# EAGLE design EndingsACMixOutput (EAGLE 9.6.2)
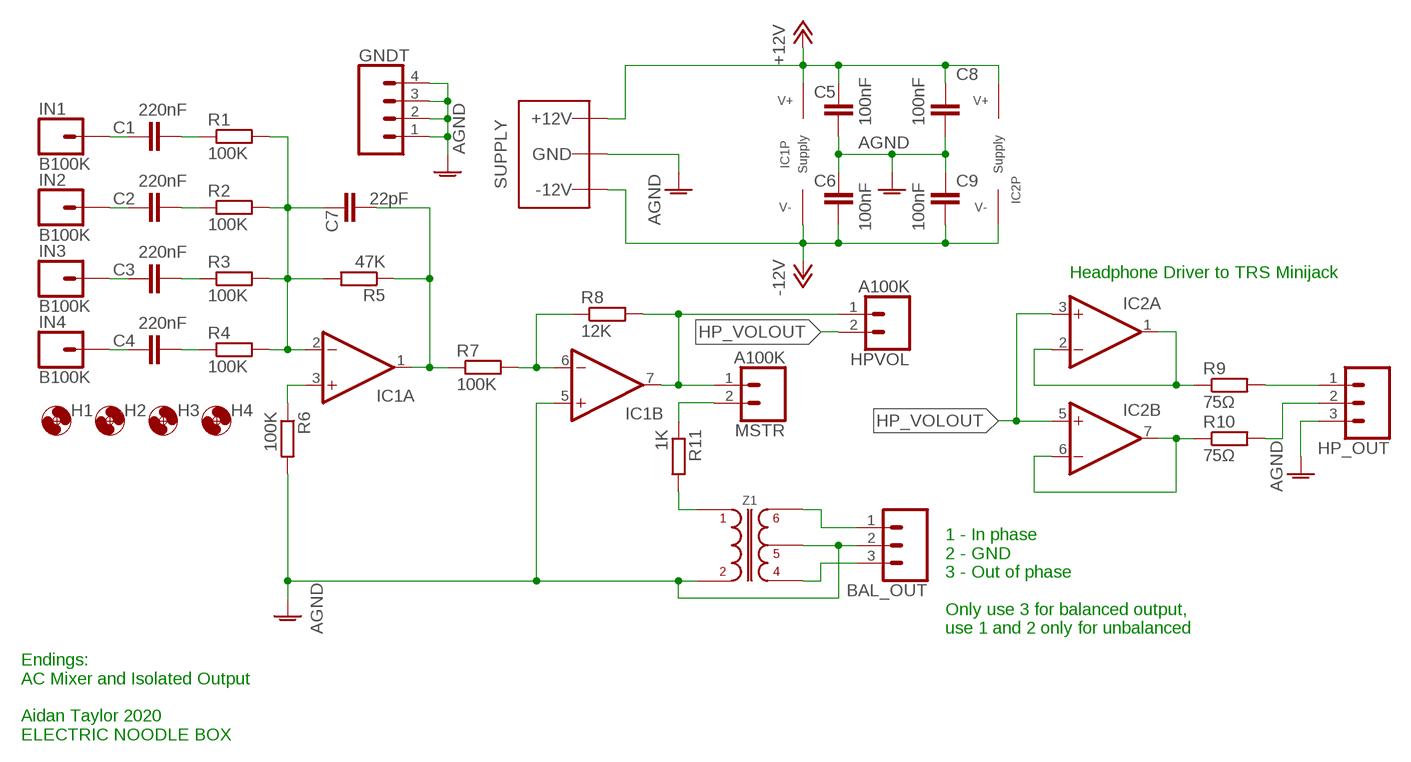
[diagram p0: schematic, sheet 1]

## Parts
BAL_OUT  3XWIREPAD  [1X03]
C1  220nF  C-EU050-025X075  [C050-025X075]
C2  220nF  C-EU050-025X075  [C050-025X075]
C3  220nF  C-EU050-025X075  [C050-025X075]
C4  220nF  C-EU050-025X075  [C050-025X075]
C5  100nF  C-EU050-025X075  [C050-025X075]
C6  100nF  C-EU050-025X075  [C050-025X075]
C7  22pF  C-EU050-025X075  [C050-025X075]
C8  100nF  C-EU050-025X075  [C050-025X075]
C9  100nF  C-EU050-025X075  [C050-025X075]
GNDT  4XWIREPAD  [1X04]
H1  MOUNT-HOLE3.2  [3,2]
H2  MOUNT-HOLE3.2  [3,2]
H3  MOUNT-HOLE3.2  [3,2]
H4  MOUNT-HOLE3.2  [3,2]
HP_OUT  3XWIREPAD  [1X03]
HPVOL  A100K  2XWIREPAD  [1X02]
IC1  TL0X2DIL  [DIL08]
IC2  TL0X2DIL  [DIL08]
IN1  B100K  1XWIREPAD  [1X01]
IN2  B100K  1XWIREPAD  [1X01]
IN3  B100K  1XWIREPAD  [1X01]
IN4  B100K  1XWIREPAD  [1X01]
MSTR  A100K  2XWIREPAD  [1X02]
R1  100K  R-EU_0207/10  [0207/10]
R2  100K  R-EU_0207/10  [0207/10]
R3  100K  R-EU_0207/10  [0207/10]
R4  100K  R-EU_0207/10  [0207/10]
R5  47K  R-EU_0207/10  [0207/10]
R6  100K  R-EU_0207/10  [0207/10]
R7  100K  R-EU_0207/10  [0207/10]
R8  12K  R-EU_0207/10  [0207/10]
R9  75Ω  R-EU_0207/10  [0207/10]
R10  75Ω  R-EU_0207/10  [0207/10]
R11  1K  R-EU_0207/10  [0207/10]
WP1  COMBO_SUPPLY_HEADER  [COMBINED_POWER]
Z1  Z1604_AUDIO_TRANSFORMER  [Z1604_TRANSFORMER]

## Nets
+12V: C5.1 C8.1 IC1.8(P:V+) IC2.8(P:V+) WP1.V+1(V++) WP1.V+2(V++) WP1.V+3(V++)
-12V: C6.2 C9.2 IC1.4(P:V-) IC2.4(P:V-) WP1.V-1(V--) WP1.V-2(V--) WP1.V-3(V--)
AGND: BAL_OUT.2 C5.2 C6.1 C8.2 C9.1 GNDT.1 GNDT.2 GNDT.3 GNDT.4 HP_OUT.3 IC1.5(B:+IN) R6.2 WP1.GND1(AGND) WP1.GND2(AGND) WP1.GND3(AGND) WP1.GND4(AGND) WP1.GND5(AGND) WP1.GND6(AGND) WP1.GND7(AGND) WP1.GND8(AGND) Z1.T3 Z1.T5
HP_VOLOUT: HPVOL.2 IC2.3(A:+IN) IC2.5(B:+IN)
N$1: C4.1 IN4.1
N$2: C7.1 IC1.2(A:-IN) R1.2 R2.2 R3.2 R4.2 R5.2
N$3: C7.2 IC1.1(A:OUT) R5.1 R7.1
N$4: IC1.6(B:-IN) R7.2 R8.1
N$5: HPVOL.1 IC1.7(B:OUT) MSTR.1 R8.2
N$6: C3.1 IN3.1
N$7: IC1.3(A:+IN) R6.1
N$8: C1.2 R1.1
N$9: C2.2 R2.1
N$10: C3.2 R3.1
N$11: C4.2 R4.1
N$12: C2.1 IN2.1
N$13: C1.1 IN1.1
N$14: MSTR.2 R11.1
N$15: BAL_OUT.1 Z1.T6
N$17: BAL_OUT.3 Z1.T4
N$18: IC2.1(A:OUT) IC2.2(A:-IN) R9.1
N$19: HP_OUT.1 R9.2
N$20: IC2.6(B:-IN) IC2.7(B:OUT) R10.1
N$21: HP_OUT.2 R10.2
N$22: R11.2 Z1.T1

## Notes on the sheet
- Headphone Driver to TRS Minijack
- 1 - In phase
  2 - GND
  3 - Out of phase
  
  Only use 3 for balanced output, 
  use 1 and 2 only for unbalanced
- Endings:
  AC Mixer and Isolated Output
  
  Aidan Taylor 2020
  ELECTRIC NOODLE BOX

## Library data of the parts
BAL_OUT HP_OUT = ElectricNoodleBox:3XWIREPAD
C1-C9 = rcl:C-EU: CAPACITOR, European symbol; SPICEPREFIX: C
GNDT = ElectricNoodleBox:4XWIREPAD
H1-H4 = holes:MOUNT-HOLE: MOUNTING HOLE with drill center marker
HPVOL MSTR = ElectricNoodleBox:2XWIREPAD
IC1 IC2 = ElectricNoodleBox:TL0X2
IN1-IN4 = ElectricNoodleBox:1XWIREPAD
R1-R11 = rcl:R-EU_: RESISTOR, European symbol; SPICEPREFIX: R
WP1 = ElectricNoodleBox:COMBO_SUPPLY_HEADER
Z1 = ElectricNoodleBox:Z1604_AUDIO_TRANSFORMER

## Board
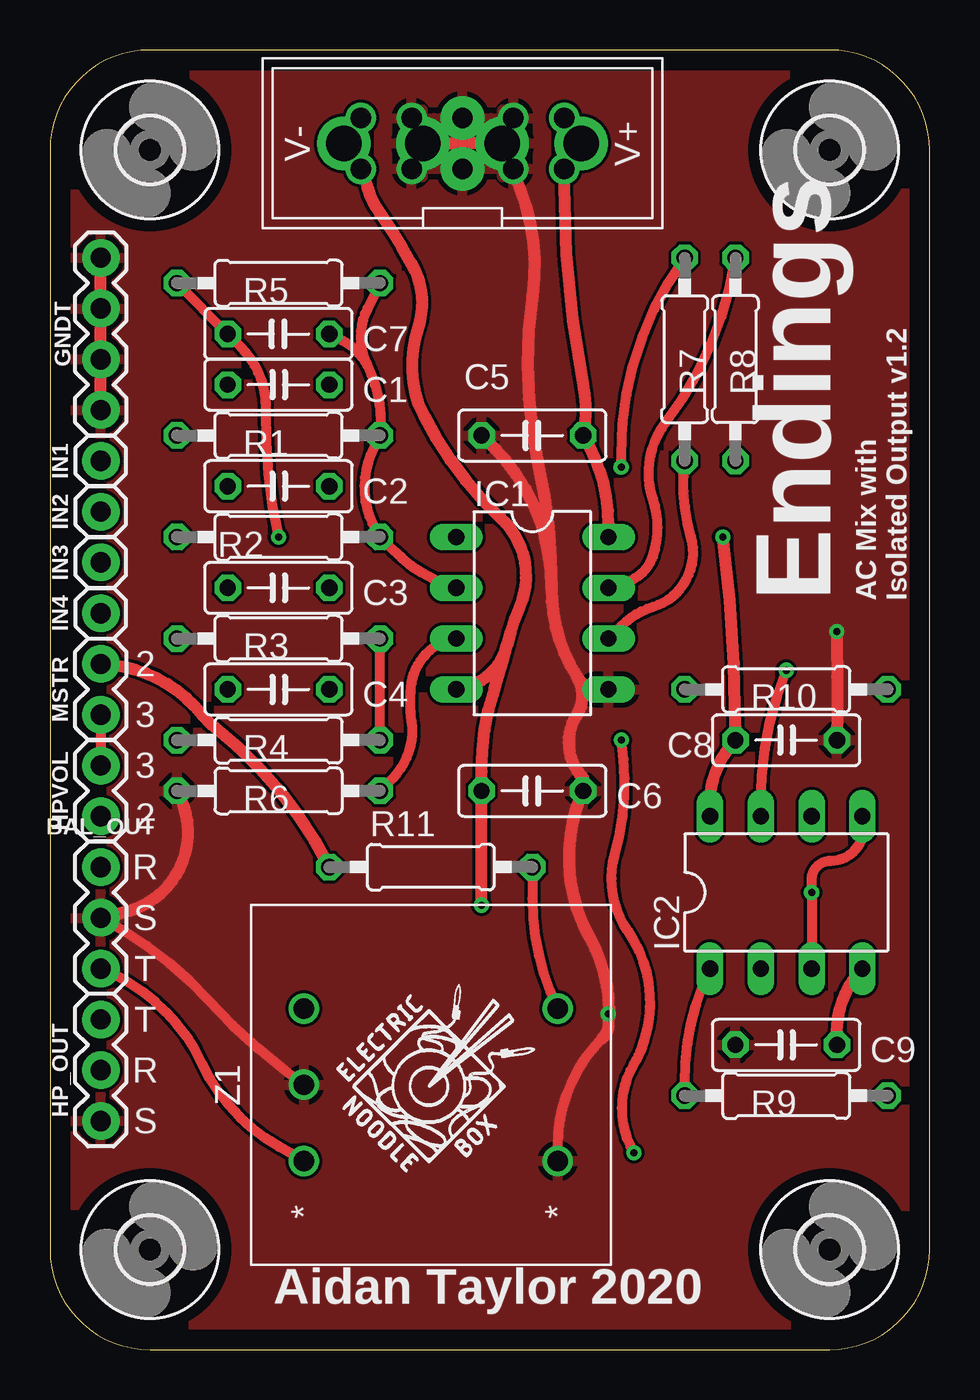
[diagram p1: board, top side]
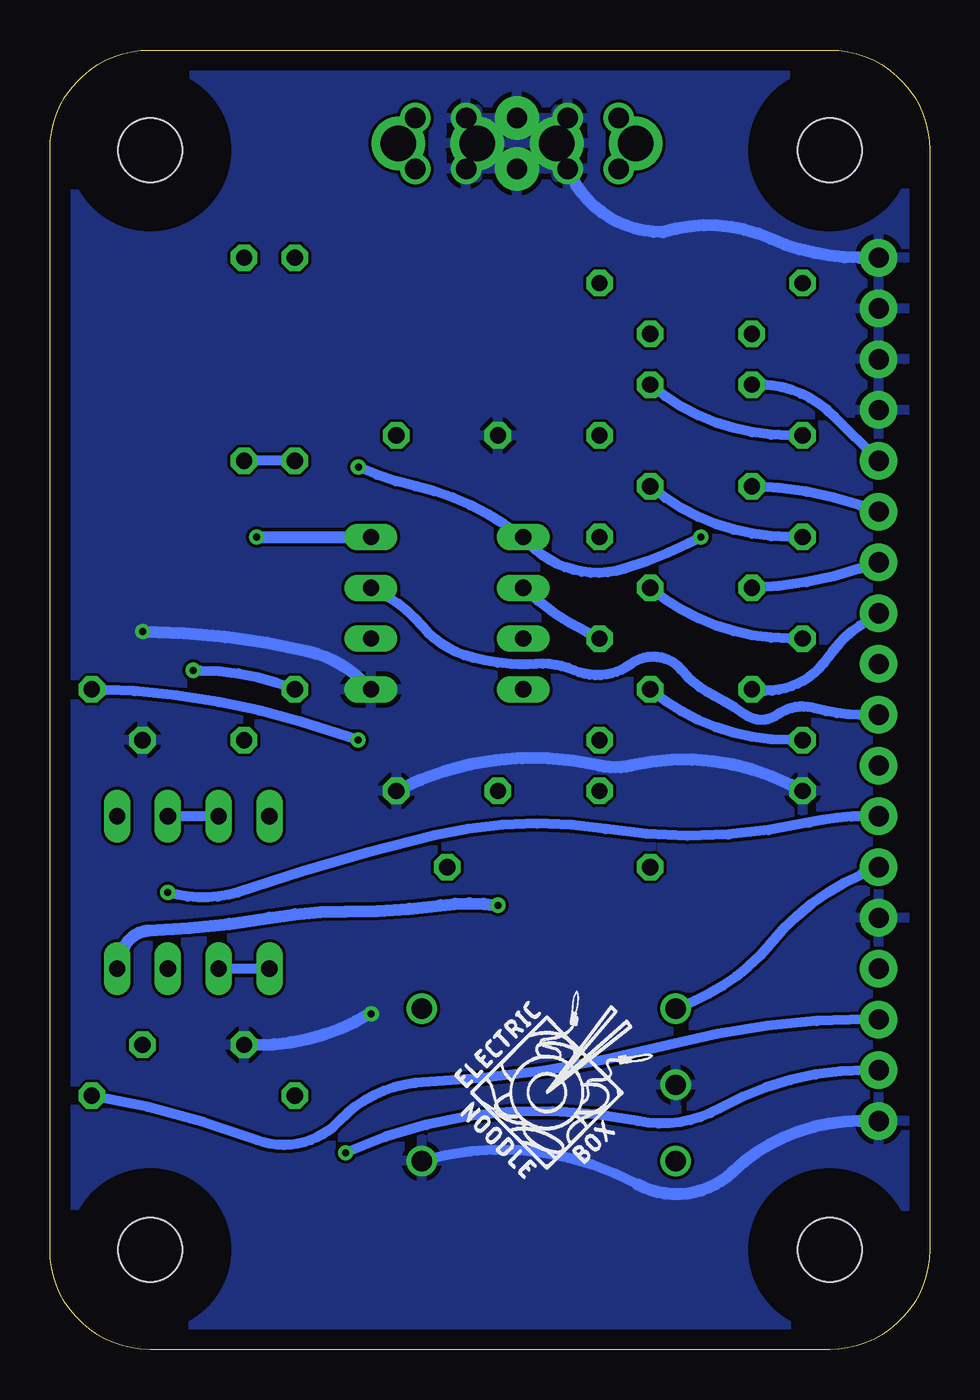
[diagram p2: board, bottom side, seen from below]

Size 44 x 65 mm. Coordinates in mm from the lower left corner, seen from the top.
Outline: 5,0 39,0 arc90 44,5 44,60 arc90 39,65 5,65 arc90 0,60 0,5 arc90 5,0
Copper layers (1*16): Top 0.035mm / dielectric 1.5mm / Bottom 0.035mm
Design rules "default": minimum track width 6mil, minimum drill 0.35mm, track to track 6mil, track to pad 6mil, pad to pad 6mil, via to via 6mil, smd to smd 6mil, copper to edge 40mil, drill to drill 6mil, minimum pad ring 10mil, minimum via ring 8mil, stop-mask expansion 4mil, vias tented up to drill 0mil, thermal gap 10mil

### Footprints (pad centres in the part's own frame; a part is rotated, then mirrored left to right if it is on the bottom)
1X03 = drill 1.016 pad 1.88: 1 0,0; 2 2.54,0; 3 5.08,0
C050-025X075 = drill 0.813 octagon: 1 -2.54,0; 2 2.54,0
1X04 = drill 1.016 pad 1.88: 1 0,0; 2 2.54,0; 3 5.08,0; 4 7.62,0
3,2 = hole 3.2: 0,0
1X02 = drill 1.016 pad 1.88: 1 0,0; 2 2.54,0
DIL08 = drill 0.813 long: 1 -3.81,-3.81; 2 -1.27,-3.81; 3 1.27,-3.81; 4 3.81,-3.81; 5 3.81,3.81; 6 1.27,3.81; 7 -1.27,3.81; 8 -3.81,3.81
1X01 = drill 1.016 pad 1.88: 1 0,0
0207/10 = drill 0.813 octagon: 1 -5.08,0; 2 5.08,0
COMBINED_POWER = drill 1.78: GND1 -1.98,0; GND2 1.98,0; V+1 -5.94,0; V-1 5.94,0 | drill 1.016: GND3 -2.54,1.27; GND5 2.54,1.27; GND6 -2.54,-1.27; GND8 2.54,-1.27; V+2 -5.08,1.27; V+3 -5.08,-1.27; V-2 5.08,1.27; V-3 5.08,-1.27 | drill 1.016 pad 2.184: GND4 0,1.27; GND7 0,-1.27
Z1604_TRANSFORMER = drill 1.016: T1 -3.81,6.35; T3 3.81,6.35; T4 3.81,-6.35; T5 0,-6.35; T6 -3.81,-6.35

### Placement (x,y rotation side)
BAL_OUT  2.54,24.13 270 top
C1  11.43,48.26 0 top
C2  11.43,43.18 0 top
C3  11.43,38.1 0 top
C4  11.43,33.02 0 top
C5  24.13,45.72 180 top
C6  24.13,27.94 180 top
C7  11.43,50.8 180 top
C8  36.83,30.48 0 top
C9  36.83,15.24 0 top
GNDT  2.54,46.99 90 top
H1  5,5 0 top
H2  39,5 0 top
H3  5,60 0 top
H4  39,60 0 top
HP_OUT  2.54,16.51 270 top
HPVOL  2.54,29.21 270 top
IC1  24.13,36.83 270 top
IC2  36.83,22.86 0 top
IN1  2.54,44.45 0 top
IN2  2.54,41.91 0 top
IN3  2.54,39.37 0 top
IN4  2.54,36.83 0 top
MSTR  2.54,31.75 90 top
R1  11.43,45.72 0 top
R2  11.43,40.64 0 top
R3  11.43,35.56 0 top
R4  11.43,30.48 0 top
R5  11.43,53.34 0 top
R6  11.43,27.94 180 top
R7  31.75,49.53 270 top
R8  34.29,49.53 90 top
R9  36.83,12.7 0 top
R10  36.83,33.02 0 top
R11  19.05,24.13 0 top
U$1  [LOGO10X10]  14.29,8.57 0 top
U$2  [LOGO10X10]  23.81,8.26 0 bottom
WP1  20.64,60.33 180 top
Z1  19.05,13.24 270 top

### Tracks (layer width: path | path; a pad name or v marks a point on that pad's centre or on a via)
+12V  (via drill 0.35)
  Top 0.61: IC1.8 27.94,41.27 arc32 C5.1 arc22 26.67,48.26 arc-11 25.72,58.1 WP1.V+2 WP1.V+1 WP1.V+3 | IC2.8 33.02,27.3 arc-44 C8.1 34.29,31.11 arc8 v33.66,40.64
  Bottom 0.61: v33.66,40.64 IC1.8
-12V  (via drill 0.35)
  Top 0.61: 22.86,35.24 arc-9 23.5,37.15 arc70 22.54,41.59 arc-21 18.73,46.67 18.41,47.31 arc-36 18.41,51.12 arc47 18.1,54.29 arc5 16.51,56.83 arc-16 15.88,58.1 WP1.V-2 WP1.V-1 WP1.V-3 | 22.86,35.24 arc-70 IC1.4 | 22.86,35.24 arc-3 22.23,33.02 arc17 21.59,28.89 C6.2 v21.59,22.23 | C9.2 39.37,15.88 arc-44 IC2.4
  Bottom 0.61: IC2.4 40.32,20 arc69 39.05,20.95 arc-8 33.02,21.59 arc10 29.21,21.91 arc-8 24.45,22.23 arc16 v21.59,22.23
AGND  (via drill 0.35)
  Top 0.508: Z1.T3 25.4,10.16 arc-45 27.62,15.56 | Z1.T5 11.75,13.97 arc-10 7.94,17.46 arc20 BAL_OUT.2
  Top 0.61: C5.2 22.23,45.09 arc-46 25.08,38.1 | 25.08,38.1 arc33 26.35,33.66 | 26.35,33.66 arc72 IC1.5 | 27.94,16.19 arc33 26.99,20.64 arc-53 C6.1 26.67,28.57 arc-76 26.35,31.75 arc65 26.35,33.66 | WP1.GND5 WP1.GND2 | WP1.GND2 WP1.GND8 | WP1.GND2 20.64,60.33 | WP1.GND4 20.64,60.33 | WP1.GND7 20.64,60.33 | WP1.GND1 23.5,58.1 arc-30 24.13,52.7 arc20 24.45,44.13 arc-13 25.08,38.1 | WP1.GND1 20.64,60.33 | WP1.GND1 WP1.GND6 | GNDT.1 GNDT.2 GNDT.3 GNDT.4 | v27.93,16.78 27.94,16.19 | v39.37,35.91 39.37,35.24 arc-1 C8.2 | 27.94,16.19 arc-44 27.62,15.56 | BAL_OUT.2 3.81,21.91 arc106 R6.2
  Bottom 0.508: 14.61,8.26 arc-44 Z1.T3
  Bottom 0.61: WP1.GND5 arc-67 13.34,55.88 arc42 7.94,55.56 arc-24 3.49,54.61 GNDT.4 | C9.1 33.66,15.24 arc-31 27.94,16.83 arc211 v27.93,16.78 | IC1.5 28.26,33.34 arc-32 31.11,34.92 arc-13 39.37,35.88 arc193 v39.37,35.91 | R6.2 6.99,28.26 arc-39 14.92,29.21 arc26 16.51,29.21 arc-40 C6.1 | HP_OUT.3 3.49,11.43 arc-44 9.84,8.89 arc72 14.61,8.26
  pour Top: 0,0 44,0 44,65 0,65
  pour Bottom: 0,0 44,0 44,65 0,65
HP_VOLOUT  (via drill 0.35)
  Top 0.508: IC2.3 v38.1,22.86 38.1,23.5 arc-90 39.05,24.45 arc109 IC2.5
  Bottom 0.508: v38.1,22.86 arc-33 34.61,22.86 arc6 24.77,25.72 arc22 16.19,26.04 arc-22 6.03,26.35 arc13 3.17,26.67 HPVOL.2
N$1
  Bottom 0.508: IN4.1 3.49,36.2 arc-23 5.08,34.61 arc67 C4.1
N$2
  Top 0.508: IC1.2 arc-28 17.14,40.01 R2.2 arc-61 16.19,45.09 R1.2 arc33 15.88,49.21 | R4.2 R3.2 | C7.1 14.61,50.48 arc-37 15.88,49.21 | R5.2 15.88,52.07 arc53 15.88,49.21
  Bottom 0.508: R3.2 17.14,35.88 arc17 IC1.2
N$3  (via drill 0.35)
  Top 0.508: R5.1 C7.2 9.53,50.16 arc-46 10.79,46.99 arc14 v11.43,40.64 | v28.57,44.13 28.57,44.77 arc-36 R7.1
  Bottom 0.508: v11.43,40.64 12.06,40.32 arc10 15.24,39.05 arc69 IC1.1 21.27,41.27 arc-21 25.72,43.18 arc11 v28.57,44.13
N$4
  Top 0.508: IC1.6 28.57,36.2 arc-28 30.16,37.15 arc89 32.07,40.64 arc-22 R7.2
  Bottom 0.508: R7.2 R8.1
N$5
  Top 0.508: IC1.7 28.89,38.42 arc53 30.16,39.69 arc37 30.16,42.55 arc-56 30.8,46.35 arc29 R8.2 | MSTR.1 HPVOL.1
  Bottom 0.508: MSTR.1 3.49,31.75 arc16 5.71,32.07 arc-51 7.62,31.75 arc70 9.21,31.75 arc-8 10.79,32.7 arc24 12.38,33.97 arc-87 14.92,34.29 arc60 17.78,33.97 arc-28 19.68,34.29 arc9 20.95,34.29 arc9 22.86,34.61 arc36 25.4,36.2 arc-26 IC1.7
N$6
  Bottom 0.508: IN3.1 3.49,39.05 arc17 C3.1
N$7
  Top 0.508: R6.1 17.14,28.57 arc53 18.1,31.43 arc-16 18.1,33.34 arc-74 IC1.3
N$8
  Bottom 0.508: R1.1 6.99,45.72 arc40 C1.2
N$9
  Bottom 0.508: R2.1 6.99,40.64 arc40 C2.2
N$10
  Bottom 0.508: R3.1 6.99,35.56 arc40 C3.2
N$11
  Bottom 0.508: R4.1 6.99,30.48 arc40 C4.2
N$12
  Bottom 0.508: IN2.1 3.49,42.23 arc-17 C2.1
N$13
  Bottom 0.508: C1.1 arc48 4.76,46.67 IN1.1
N$14
  Top 0.61: MSTR.2 arc-50 7.62,31.75 arc13 8.26,31.11 arc-24 R11.1
N$15
  Bottom 0.508: Z1.T6 11.75,17.46 arc-27 7.94,20.32 arc30 BAL_OUT.1
N$17
  Top 0.508: Z1.T4 11.43,10.16 arc-35 7.62,14.29 arc43 BAL_OUT.3
N$18
  Top 0.508: R9.1 31.75,13.34 arc-25 IC2.1
  Bottom 0.508: IC2.1 IC2.2
N$19
  Bottom 0.508: R9.2 arc11 33.66,10.48 arc-67 29.53,11.43 arc40 25.72,13.34 arc-12 13.02,15.24 arc15 3.17,16.51 HP_OUT.1
N$20  (via drill 0.35)
  Top 0.508: IC2.7 35.56,27.3 arc-22 v36.83,33.97
  Bottom 0.508: IC2.7 IC2.6 | v36.83,33.97 36.51,33.97 arc23 R10.1
N$21  (via drill 0.35)
  Top 0.508: v28.59,30.48 arc205 28.57,30.48 arc-25 28.26,24.77 arc50 28.89,20.95 arc-57 29.53,14.92 arc-8 29.21,14.29 arc61 v29.21,9.84
  Bottom 0.508: v28.59,30.48 29.53,30.8 arc-8 35.56,32.38 arc-10 R10.2 | HP_OUT.2 3.17,13.97 arc-29 10.48,12.06 arc41 14.61,11.43 arc-36 v29.21,9.84
N$22
  Top 0.508: R11.2 24.13,22.54 arc26 Z1.T1

### Text on the board
tPlace: Endings | AC Mix with / Isolated Output v1.2 | 2 | 3 | 3 | 2 | R | S | T | T | R | S | Aidan Taylor 2020